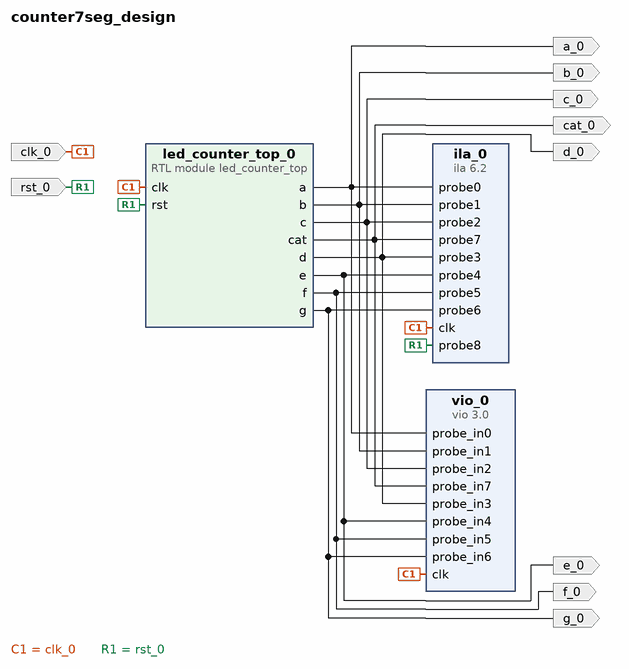
[diagram p0: block diagram of the top level]
# Vivado block design counter7seg_design, xc7a35ticsg324-1L, Vivado 2025.2
create_bd_design counter7seg_design

create_bd_port -dir I -type clk clk_0
create_bd_port -dir O a_0
create_bd_port -dir O b_0
create_bd_port -dir O c_0
create_bd_port -dir O d_0
create_bd_port -dir O e_0
create_bd_port -dir O f_0
create_bd_port -dir O g_0
create_bd_port -dir O cat_0
create_bd_port -dir I -type rst rst_0

create_bd_cell -type ip -vlnv xilinx.com:ip:vio:3.0 vio_0
set_property -dict {CONFIG.C_NUM_PROBE_IN 8 CONFIG.C_NUM_PROBE_OUT 0 CONFIG.C_PROBE_IN0_WIDTH 1} [get_bd_cells vio_0]
create_bd_cell -type ip -vlnv xilinx.com:ip:ila:6.2 ila_0
set_property -dict {CONFIG.C_MONITOR_TYPE Native CONFIG.C_NUM_OF_PROBES 9} [get_bd_cells ila_0]
create_bd_cell -type module -reference led_counter_top led_counter_top_0

# ---- connections ----

connect_bd_net -net clk_0_1 [get_bd_ports clk_0] [get_bd_pins led_counter_top_0/clk] [get_bd_pins vio_0/clk] [get_bd_pins ila_0/clk]
connect_bd_net [get_bd_pins led_counter_top_0/a] [get_bd_ports a_0] [get_bd_pins vio_0/probe_in0] [get_bd_pins ila_0/probe0]
connect_bd_net [get_bd_pins led_counter_top_0/b] [get_bd_ports b_0] [get_bd_pins vio_0/probe_in1] [get_bd_pins ila_0/probe1]
connect_bd_net [get_bd_pins led_counter_top_0/c] [get_bd_ports c_0] [get_bd_pins vio_0/probe_in2] [get_bd_pins ila_0/probe2]
connect_bd_net [get_bd_pins led_counter_top_0/cat] [get_bd_ports cat_0] [get_bd_pins vio_0/probe_in7] [get_bd_pins ila_0/probe7]
connect_bd_net [get_bd_pins led_counter_top_0/d] [get_bd_ports d_0] [get_bd_pins vio_0/probe_in3] [get_bd_pins ila_0/probe3]
connect_bd_net [get_bd_pins led_counter_top_0/e] [get_bd_ports e_0] [get_bd_pins vio_0/probe_in4] [get_bd_pins ila_0/probe4]
connect_bd_net [get_bd_pins led_counter_top_0/f] [get_bd_ports f_0] [get_bd_pins vio_0/probe_in5] [get_bd_pins ila_0/probe5]
connect_bd_net [get_bd_pins led_counter_top_0/g] [get_bd_ports g_0] [get_bd_pins vio_0/probe_in6] [get_bd_pins ila_0/probe6]
connect_bd_net -net rst_0_1 [get_bd_ports rst_0] [get_bd_pins led_counter_top_0/rst] [get_bd_pins ila_0/probe8]

validate_bd_design
save_bd_design
